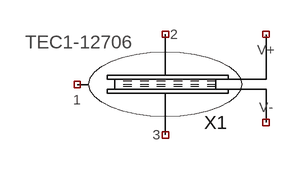
[diagram p0: schematic TEM_12706_TEC_symbol.asc]
TEM_12706_TEC_symbol.asc, the LTspice schematic file:
Version 4
SHEET 1 880 940
SYMBOL TEM-12706 176 544 R0
SYMATTR InstName X1

The netlist it stands for:
* TEM_12706_TEC_symbol.asc
XX1 NC_01 NC_02 NC_03 NC_04 NC_05 TEM-12706  ; pins V+ 1 2 3 V-
.backanno
.end